# Altium schematic sheet ASCII_07_LMS7002M_Power.SchDoc: LMS7002M power supply
size A3 portrait; Organization: Lime Microsystems; Address1: Surrey Tech Centre; Address2: Guildford GU2 7YG; Address3: Surrey; Address4: United Kingdom; Revision: v1.4s; SheetNumber: 7; SheetTotal: 15; PageSetup: Record=PageOptions|CenterHorizontal=True|CenterVertical=True|PrintScale=0.70|XCorrection=1.00|YCorrection=1.00|PrintKind=1|BorderSize=5000000|LeftOffset=0|BottomOffset=0|Orientation=1|PaperLength=2970|PaperWidth=2100|Scale=100|PaperSource=7|PrintQuality=600|MediaType=1|DitherType=10|PrintScaleMode=1|PaperKind=A4|PaperIndex=9
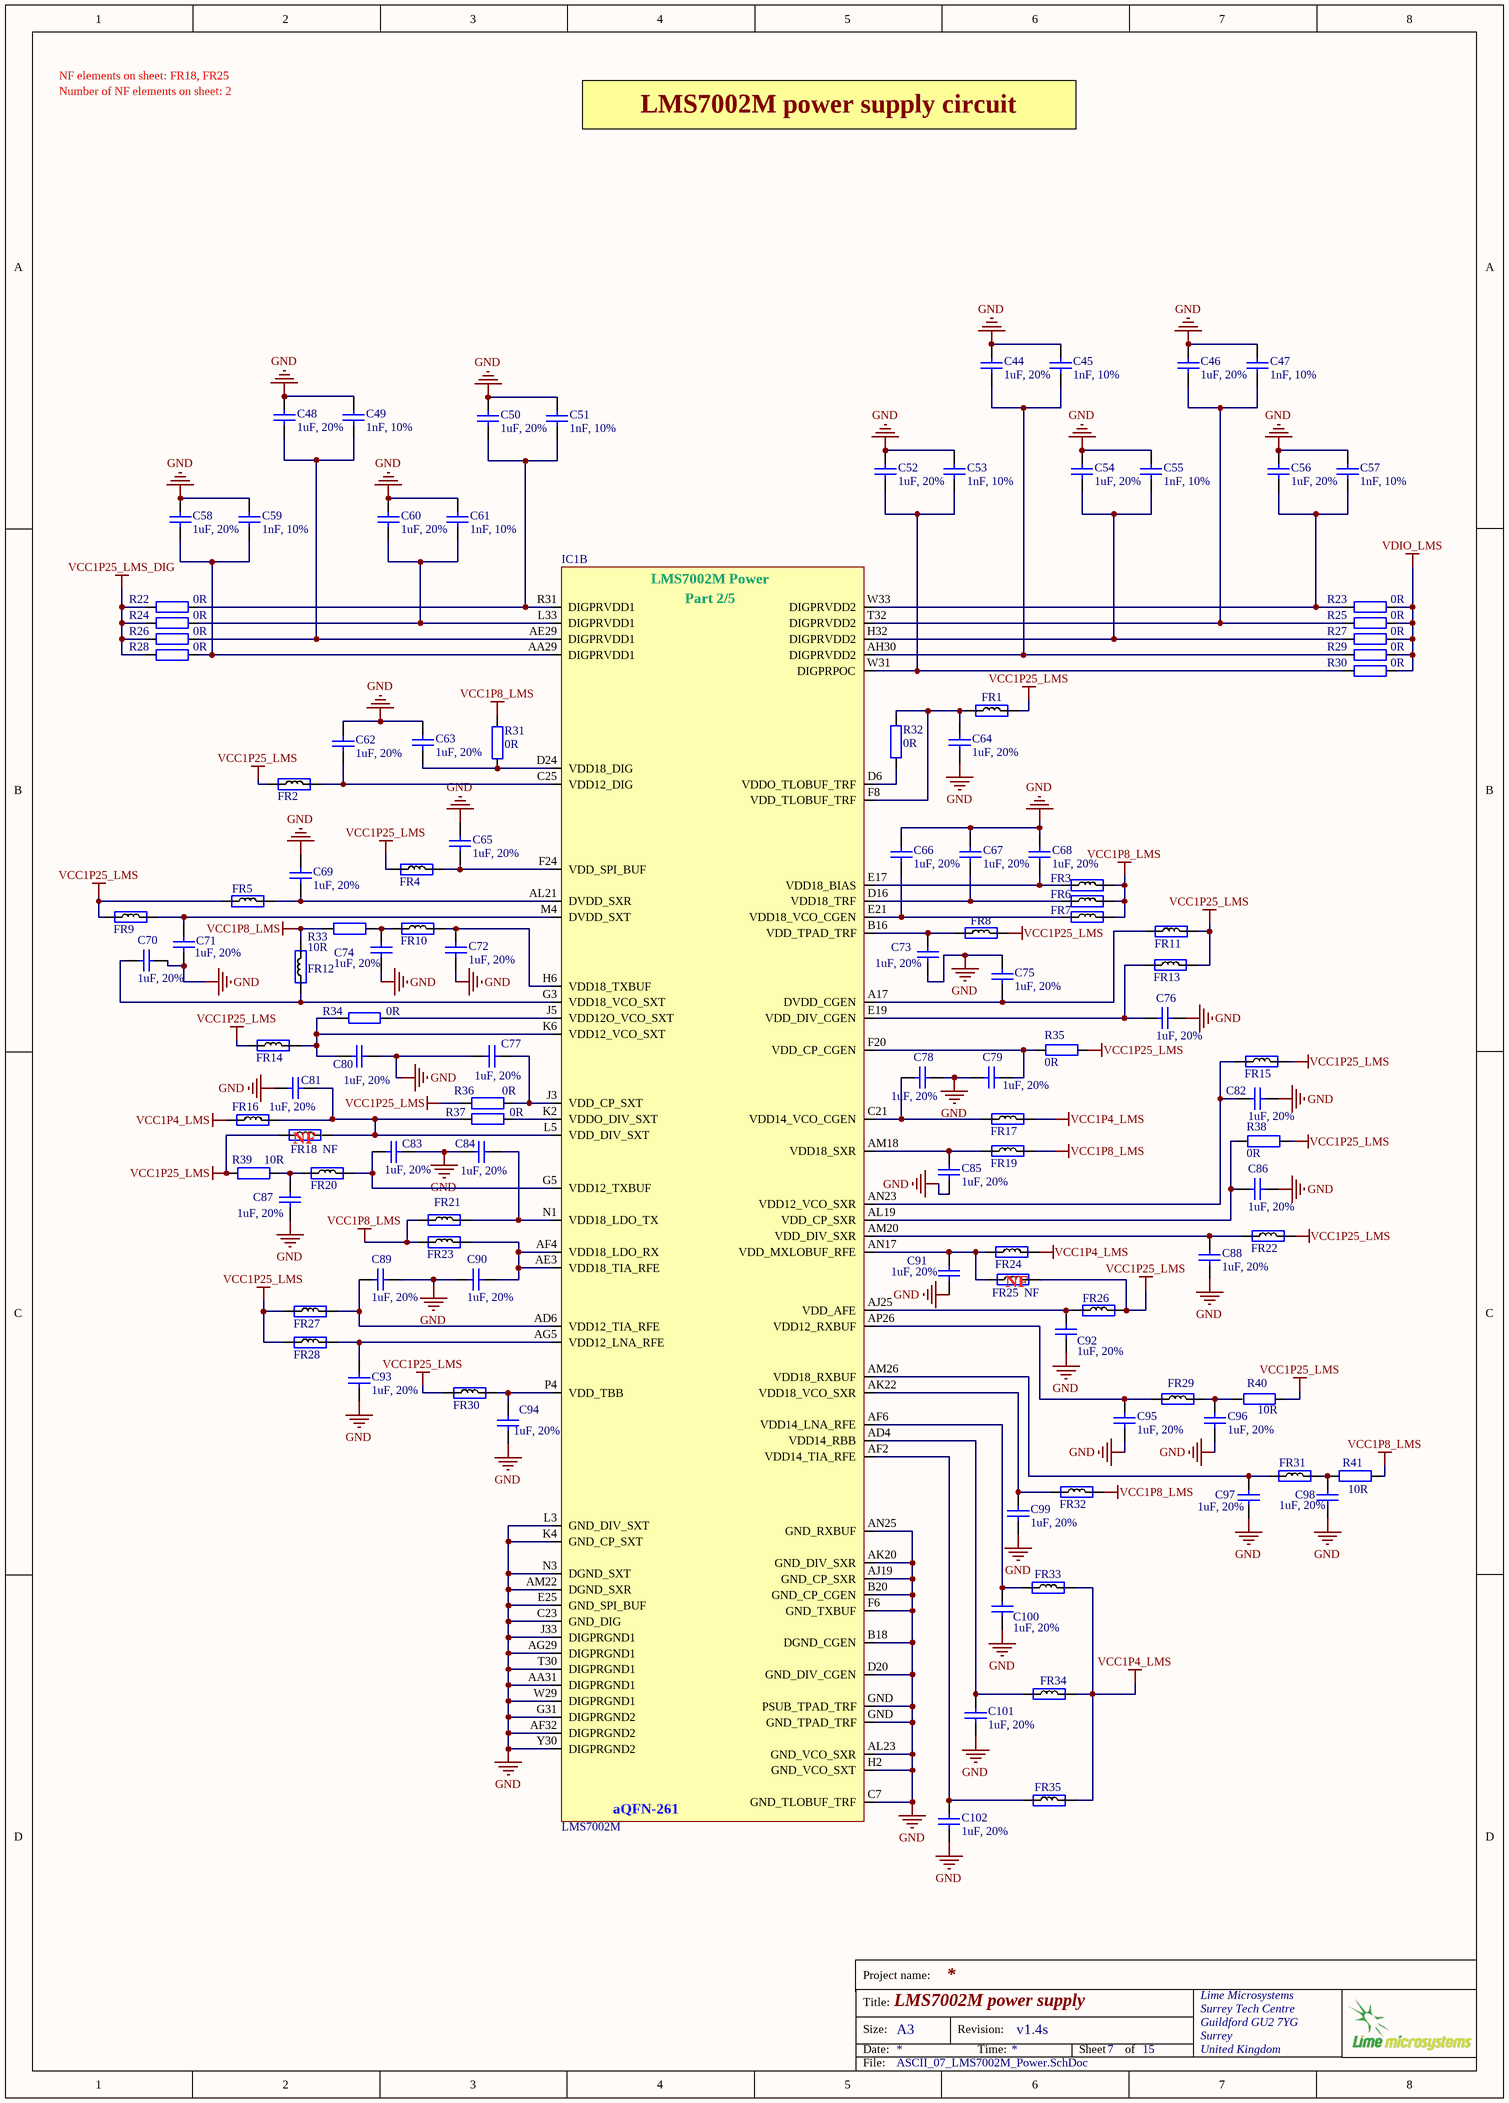
[diagram p0: ASCII_07_LMS7002M_Power.SchDoc]

## Parts
C44  1uF, 20%  [CAP0201]
C45  1nF, 10%  [CAP0201]
C46  1uF, 20%  [CAP0201]
C47  1nF, 10%  [CAP0201]
C48  1uF, 20%  [CAP0201]
C49  1nF, 10%  [CAP0201]
C50  1uF, 20%  [CAP0201]
C51  1nF, 10%  [CAP0201]
C52  1uF, 20%  [CAP0201]
C53  1nF, 10%  [CAP0201]
C54  1uF, 20%  [CAP0201]
C55  1nF, 10%  [CAP0201]
C56  1uF, 20%  [CAP0201]
C57  1nF, 10%  [CAP0201]
C58  1uF, 20%  [CAP0201]
C59  1nF, 10%  [CAP0201]
C60  1uF, 20%  [CAP0201]
C61  1nF, 10%  [CAP0201]
C62  1uF, 20%  [CAP0201]
C63  1uF, 20%  [CAP0201]
C64  1uF, 20%  [CAP0201]
C65  1uF, 20%  [CAP0201]
C66  1uF, 20%  [CAP0201]
C67  1uF, 20%  [CAP0201]
C68  1uF, 20%  [CAP0201]
C69  1uF, 20%  [CAP0201]
C70  1uF, 20%  [CAP0201]
C71  1uF, 20%  [CAP0201]
C72  1uF, 20%  [CAP0201]
C73  1uF, 20%  [CAP0201]
C74  1uF, 20%  [CAP0201]
C75  1uF, 20%  [CAP0201]
C76  1uF, 20%  [CAP0201]
C77  1uF, 20%  [CAP0201]
C78  1uF, 20%  [CAP0201]
C79  1uF, 20%  [CAP0201]
C80  1uF, 20%  [CAP0201]
C81  1uF, 20%  [CAP0201]
C82  1uF, 20%  [CAP0201]
C83  1uF, 20%  [CAP0201]
C84  1uF, 20%  [CAP0201]
C85  1uF, 20%  [CAP0201]
C86  1uF, 20%  [CAP0201]
C87  1uF, 20%  [CAP0201]
C88  1uF, 20%  [CAP0201]
C89  1uF, 20%  [CAP0201]
C90  1uF, 20%  [CAP0201]
C91  1uF, 20%  [CAP0201]
C92  1uF, 20%  [CAP0201]
C93  1uF, 20%  [CAP0201]
C94  1uF, 20%  [CAP0201]
C95  1uF, 20%  [CAP0201]
C96  1uF, 20%  [CAP0201]
C97  1uF, 20%  [CAP0201]
C98  1uF, 20%  [CAP0201]
C99  1uF, 20%  [CAP0201]
C100  1uF, 20%  [CAP0201]
C101  1uF, 20%  [CAP0201]
C102  1uF, 20%  [CAP0201]
FR1  600R, 0.27A  [RES0201]  (value not drawn)
FR2  600R, 0.27A  [RES0201]  (value not drawn)
FR3  600R, 0.27A  [RES0201]  (value not drawn)
FR4  600R, 0.27A  [RES0201]  (value not drawn)
FR5  600R, 0.27A  [RES0201]  (value not drawn)
FR6  600R, 0.27A  [RES0201]  (value not drawn)
FR7  600R, 0.27A  [RES0201]  (value not drawn)
FR8  600R, 0.27A  [RES0201]  (value not drawn)
FR9  600R, 0.27A  [RES0201]  (value not drawn)
FR10  600R, 0.27A  [RES0201]  (value not drawn)
FR11  600R, 0.27A  [RES0201]  (value not drawn)
FR12  600R, 0.27A  [RES0201]  (value not drawn)
FR13  600R, 0.27A  [RES0201]  (value not drawn)
FR14  600R, 0.27A  [RES0201]  (value not drawn)
FR15  600R, 0.27A  [RES0201]  (value not drawn)
FR16  600R, 0.27A  [RES0201]  (value not drawn)
FR17  600R, 0.27A  [RES0201]  (value not drawn)
FR18  Assembly Info: NF  [RES0201]  (hidden comment: 600R, 0.27A)
FR19  600R, 0.27A  [RES0201]  (value not drawn)
FR20  600R, 0.27A  [RES0201]  (value not drawn)
FR21  600R, 0.27A  [RES0201]  (value not drawn)
FR22  600R, 0.27A  [RES0201]  (value not drawn)
FR23  600R, 0.27A  [RES0201]  (value not drawn)
FR24  600R, 0.27A  [RES0201]  (value not drawn)
FR25  Assembly Info: NF  [RES0201]  (hidden comment: 600R, 0.27A)
FR26  600R, 0.27A  [RES0201]  (value not drawn)
FR27  600R, 0.27A  [RES0201]  (value not drawn)
FR28  600R, 0.27A  [RES0201]  (value not drawn)
FR29  600R, 0.27A  [RES0201]  (value not drawn)
FR30  600R, 0.27A  [RES0201]  (value not drawn)
FR31  600R, 0.27A  [RES0201]  (value not drawn)
FR32  600R, 0.27A  [RES0201]  (value not drawn)
FR33  600R, 0.27A  [RES0201]  (value not drawn)
FR34  600R, 0.27A  [RES0201]  (value not drawn)
FR35  600R, 0.27A  [RES0201]  (value not drawn)
IC1  LMS7002M  [LMS7002M_v3]  (part B of 5)
R22  0R  [RES0402]
R23  0R  [RES0402]
R24  0R  [RES0402]
R25  0R  [RES0402]
R26  0R  [RES0402]
R27  0R  [RES0402]
R28  0R  [RES0402]
R29  0R  [RES0402]
R30  0R  [RES0402]
R31  0R  [RES0201]
R32  0R  [RES0201]
R33  10R  [RES0201]
R34  0R  [RES0201]
R35  0R  [RES0201]
R36  0R  [RES0201]
R37  0R  [RES0201]
R38  0R  [RES0201]
R39  10R  [RES0201]
R40  10R  [RES0201]
R41  10R  [RES0201]

## Nets
GND: C44.2 C45.2 C46.2 C47.2 C48.2 C49.2 C50.2 C51.2 C52.2 C53.2 C54.2 C55.2 C56.2 C57.2 C58.2 C59.2 C60.2 C61.2 C62.2 C63.2 C64.2 C65.2 C66.2 C67.2 C68.2 C69.2 C70.2 C71.2 C72.2 C73.2 C74.2 C75.2 C76.2 C77.2 C78.2 C79.2 C80.1 C81.2 C82.2 C83.2 C84.2 C85.2 C86.2 C87.2 C88.2 C89.2 C90.2 C91.2 C92.2 C93.2 C94.2 C95.2 C96.2 C97.2 C98.2 C99.2 C100.2 C101.2 C102.2 IC1.AA31(DIGPRGND1) IC1.AF32(DIGPRGND2) IC1.AG29(DIGPRGND1) IC1.AJ19(GND_CP_SXR) IC1.AK20(GND_DIV_SXR) IC1.AL23(GND_VCO_SXR) IC1.AM22(DGND_SXR) IC1.AN25(GND_RXBUF) IC1.B18(DGND_CGEN) IC1.B20(GND_CP_CGEN) IC1.C7(GND_TLOBUF_TRF) IC1.C23(GND_DIG) IC1.D20(GND_DIV_CGEN) IC1.E25(GND_SPI_BUF) IC1.F6(GND_TXBUF) IC1.G31(DIGPRGND2) IC1.GND(PSUB_TPAD_TRF) IC1.H2(GND_VCO_SXT) IC1.J33(DIGPRGND1) IC1.K4(GND_CP_SXT) IC1.L3(GND_DIV_SXT) IC1.N3(DGND_SXT) IC1.T30(DIGPRGND1) IC1.W29(DIGPRGND1) IC1.Y30(DIGPRGND2)
VCC1P4_LMS: FR16.1 FR17.2 FR24.2 FR33.2 FR34.2 FR35.2
VCC1P8_LMS: FR3.2 FR6.2 FR7.2 FR12.2 FR19.2 FR21.1 FR23.1 FR32.2 R31.2 R33.2 R41.1
VCC1P25_LMS: FR1.2 FR2.1 FR4.1 FR5.1 FR8.2 FR9.1 FR11.2 FR13.2 FR14.1 FR15.2 FR18.1 FR22.2 FR25.2 FR26.2 FR27.1 FR28.1 FR30.1 R35.1 R36.2 R38.1 R39.2 R40.1
VCC1P25_LMS_DIG: R22.2 R24.2 R26.2 R28.2
VDIO_LMS: R23.1 R25.1 R27.1 R29.1 R30.1
NetC44_1: C44.1 C45.1 IC1.AH30(DIGPRVDD2) R29.2
NetC46_1: C46.1 C47.1 IC1.T32(DIGPRVDD2) R25.2
NetC48_1: C48.1 C49.1 IC1.AE29(DIGPRVDD1) R26.1
NetC50_1: C50.1 C51.1 IC1.R31(DIGPRVDD1) R22.1
NetC52_1: C52.1 C53.1 IC1.W31(DIGPRPOC) R30.2
NetC54_1: C54.1 C55.1 IC1.H32(DIGPRVDD2) R27.2
NetC56_1: C56.1 C57.1 IC1.W33(DIGPRVDD2) R23.2
NetC58_1: C58.1 C59.1 IC1.AA29(DIGPRVDD1) R28.1
NetC60_1: C60.1 C61.1 IC1.L33(DIGPRVDD1) R24.1
NetC62_1: C62.1 FR2.2 IC1.C25(VDD12_DIG)
NetC63_1: C63.1 IC1.D24(VDD18_DIG) R31.1
NetC64_1: C64.1 FR1.1 IC1.F8(VDD_TLOBUF_TRF) R32.1
NetC65_1: C65.1 FR4.2 IC1.F24(VDD_SPI_BUF)
NetC66_1: C66.1 FR7.1 IC1.E21(VDD18_VCO_CGEN)
NetC67_1: C67.1 FR6.1 IC1.D16(VDD18_TRF)
NetC68_1: C68.1 FR3.1 IC1.E17(VDD18_BIAS)
NetC69_1: C69.1 FR5.2 IC1.AL21(DVDD_SXR)
NetC70_1: C70.1 FR12.1 IC1.G3(VDD18_VCO_SXT)
NetC71_1: C71.1 FR9.2 IC1.M4(DVDD_SXT)
NetC72_1: C72.1 FR10.2 IC1.H6(VDD18_TXBUF)
NetC73_1: C73.1 FR8.1 IC1.B16(VDD_TPAD_TRF)
NetC74_1: C74.1 FR10.1 R33.1
NetC75_1: C75.1 FR11.1 IC1.A17(DVDD_CGEN)
NetC76_1: C76.1 FR13.1 IC1.E19(VDD_DIV_CGEN)
NetC77_1: C77.1 IC1.J3(VDD_CP_SXT) R36.1
NetC78_1: C78.1 FR17.1 IC1.C21(VDD14_VCO_CGEN)
NetC79_1: C79.1 IC1.F20(VDD_CP_CGEN) R35.2
NetC80_2: C80.2 FR14.2 IC1.K6(VDD12_VCO_SXT) R34.2
NetC81_1: C81.1 FR16.2 FR18.2 IC1.L5(VDD_DIV_SXT) R37.2
NetC82_1: C82.1 FR15.1 IC1.AN23(VDD12_VCO_SXR)
NetC83_1: C83.1 FR20.2 IC1.G5(VDD12_TXBUF)
NetC84_1: C84.1 FR21.2 IC1.N1(VDD18_LDO_TX)
NetC85_1: C85.1 FR19.1 IC1.AM18(VDD18_SXR)
NetC86_1: C86.1 IC1.AL19(VDD_CP_SXR) R38.2
NetC87_1: C87.1 FR20.1 R39.1
NetC88_1: C88.1 FR22.1 IC1.AM20(VDD_DIV_SXR)
NetC89_1: C89.1 FR27.2 IC1.AD6(VDD12_TIA_RFE)
NetC90_1: C90.1 FR23.2 IC1.AE3(VDD18_TIA_RFE) IC1.AF4(VDD18_LDO_RX)
NetC91_1: C91.1 FR24.1 FR25.1 IC1.AN17(VDD_MXLOBUF_RFE)
NetC92_1: C92.1 FR26.1 IC1.AJ25(VDD_AFE)
NetC93_1: C93.1 FR28.2 IC1.AG5(VDD12_LNA_RFE)
NetC94_1: C94.1 FR30.2 IC1.P4(VDD_TBB)
NetC95_1: C95.1 FR29.1 IC1.AP26(VDD12_RXBUF)
NetC96_1: C96.1 FR29.2 R40.2
NetC97_1: C97.1 FR31.1 IC1.AM26(VDD18_RXBUF)
NetC98_1: C98.1 FR31.2 R41.2
NetC99_1: C99.1 FR32.1 IC1.AK22(VDD18_VCO_SXR)
NetC100_1: C100.1 FR33.1 IC1.AF6(VDD14_LNA_RFE)
NetC101_1: C101.1 FR34.1 IC1.AD4(VDD14_RBB)
NetC102_1: C102.1 FR35.1 IC1.AF2(VDD14_TIA_RFE)
NetIC1_D6: IC1.D6(VDDO_TLOBUF_TRF) R32.2
NetIC1_J5: IC1.J5(VDD12O_VCO_SXT) R34.1
NetIC1_K2: IC1.K2(VDDO_DIV_SXT) R37.1

## Notes on the sheet
- Number of NF elements on sheet: 2
- NF elements on sheet: FR18, FR25
- LMS7002M power supply circuit
- (near FR18) NF
- (near FR25) NF
- Project name:
- Title:
- Size:
- Date:
- A3
- Revision:
- Time:
- Sheet
- of
- File:
- (in symbol LMS7002M, part B) LMS7002M Power; Part 2/5; aQFN-261

## Library data of the parts
C44 C46 C48 C50 C52 C54 C56 C58 C60 C62-C102 = Cap_0402: Manufacturer: TDK Corporation; Manufacturer Part Number 1: C0603X5R0J105M030BC; Part Description: 1µF ±20% 6.3V X5R Ceramic Capacitor -55°C ~ 85°C Surface Mount, MLCC 0201 (0603 Metric) 0.024" L x 0.012" W (0.60mm x 0.30mm); Capacitance: 1.0µF; Voltage - Rated: 6.3V; Temperature Coefficient: X5R; Value: 1uF, 20%; Supplier 1: Digi-Key; Supplier Part Number 1: 445-8008-1-ND; Applications: General Purpose; Features: -; Lead Style: -; Ratings: -; Thickness (Max): -; Lead Spacing: -; Height - Seated (Max): -; Size / Dimension: 0.024" L x 0.012" W (0.60mm x 0.30mm); Mounting Type: Surface Mount, MLCC; Operating Temperature: -55°C ~ 85°C; Package / Case: 0201 (0603 Metric); Tolerance: ±20%; Packaging: Cut Tape (CT); Category: Capacitors; RoHS: RoHS Compliant
C45 C47 C49 C51 C53 C55 C57 C59 C61 = Cap_0402: Manufacturer Part Number 1: C0603X7R1E102K030BA; Manufacturer: TDK Corporation; Part Description: 1000pF ±10% 25V X7R Ceramic Capacitor -55°C ~ 125°C Surface Mount, MLCC 0201 (0603 Metric) 0.024" L x 0.012" W (0.60mm x 0.30mm); Voltage - Rated: 25V; Temperature Coefficient: X7R; Capacitance: 1000pF; Value: 1nF, 10%; Supplier 1: Digi-Key; Supplier Part Number 1: 445-7275-1-ND; Features: -; Package / Case: 0201 (0603 Metric); Lead Spacing: -; Mounting Type: Surface Mount, MLCC; Lead Style: -; Height - Seated (Max): -; Operating Temperature: -55°C ~ 125°C; Tolerance: ±10%; Size / Dimension: 0.024" L x 0.012" W (0.60mm x 0.30mm); Applications: General Purpose; Ratings: -; Thickness (Max): 0.013" (0.33mm); RoHS: RoHS Compliant; Packaging: Cut Tape (CT); Category: Capacitors
FR1-FR35 = Ferrite: Manufacturer Part Number 1: BK0603TS601-T; Manufacturer: Taiyo Yuden; Part Description: FERRITE BEAD 600 OHM 0201 1LN; DC Resistance (DCR): 750 mOhm Max; Filter Type: Differential Mode - Single; Impedance @ Frequency: 600 Ohm @ 100MHz; Current Rating: 270mA; Supplier 1: Digi-Key; Supplier Part Number 1: 587-3277-1-ND; Size / Dimension: 0.024" L x 0.012" W (0.60mm x 0.30mm); Package / Case: 0201 (0603 Metric); Height (Max): 0.013" (0.33mm); Mounting Type: Surface Mount; Packaging: Cut Tape (CT); RoHS: RoHS Compliant; Category: Filters; Value: 600R, 0.27A
IC1 = LMS7002M: Part Description: IC FPRF Transceiver LMS7002M; 261 pin aQFN; Manufacturer: Lime Microsystems; Manufacturer Part Number 1: LMS7002M; Supplier 1: Lime Microsystems; Supplier Part Number 1: LMS7002M
R22-R30 = Res_0402: Manufacturer Part Number 1: RC0402JR-070RL; Manufacturer: Yageo; Part Description: RES SMD 0.0OHM JUMPER 1/16W 0402; Resistance (Ohms): 0.0; Tolerance: Jumper; Power (Watts): 0.063W, 1/16W; Value: 0R; Supplier 1: Digi-Key; Supplier Part Number 1: 311-0.0JRTR-ND; Category: Resistors; Temperature Coefficient: -; Features: Moisture Resistant; Supplier Device Package: 0402; Height: 0.016" (0.40mm); Package / Case: 0402 (1005 Metric); Operating Temperature: -55°C ~ 155°C; Size / Dimension: 0.039" L x 0.020" W (1.00mm x 0.50mm); Composition: Thick Film; Packaging: Tape & Reel (TR); Number of Terminations: 2; RoHS: RoHS Compliant
R31 R32 R34-R38 = Res_0402: Manufacturer Part Number 1: MCR006YRTJ000; Manufacturer: Rohm Semiconductor; Part Description: RES SMD 0.0OHM JUMPER 1/20W 0201; Resistance (Ohms): 0.0; Power (Watts): 0.05W, 1/20W; Tolerance: Jumper; Value: 0R; Supplier 1: Digi-Key; Supplier Part Number 1: RHM0.0CCCT-ND; Number of Terminations: 2; Operating Temperature: -55°C ~ 125°C; Package / Case: 0201 (0603 Metric); Height: 0.010" (0.26mm); Supplier Device Package: 0201 (0603 Metric); Size / Dimension: 0.024" L x 0.012" W (0.60mm x 0.30mm); Temperature Coefficient: -; Category: Resistors; Features: -; RoHS: RoHS Compliant; Composition: Thick Film; Packaging: Cut Tape (CT)
R33 R39-R41 = Res_0402: Manufacturer: Panasonic Electronic Components; Manufacturer Part Number: ERJ-1GEF10R0C; Part Description: RES SMD 10 OHM 1% 1/20W 0201; Power (Watts): 0.05W, 1/20W; Resistance (Ohms): 10; Tolerance: ±1%; Temperature Coefficient: ±200ppm/°C; Value: 10R; Supplier 1: Digi-Key; Supplier Part Number 1: P10.0ABCT-ND; Package / Case: 0201 (0603 Metric); Height: 0.010" (0.26mm); Supplier Device Package: 0201; Packaging: Cut Tape (CT); Composition: Thick Film; Category: Resistors; Number of Terminations: 2; Size / Dimension: 0.024" L x 0.012" W (0.60mm x 0.30mm); Operating Temperature: -55°C ~ 125°C; Features: -; RoHS: RoHS Compliant